# Altium schematic sheet Sheet1.SchDoc
size A4
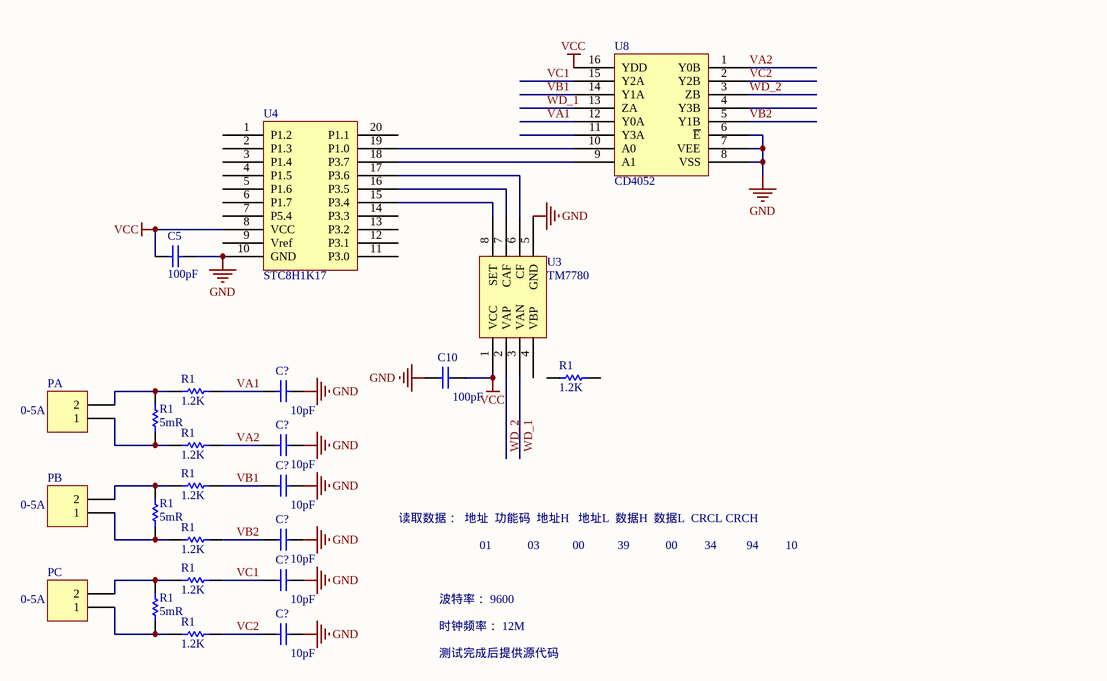
[diagram p0: Sheet1.SchDoc]

## Parts
(Parts that share a designator on the sheet are numbered #1, #2 ... from top to bottom, then left to right.)
C5  value 100pF  [RAD-0.3]  (hidden comment: Cap)
C10  value 100pF  [RAD-0.3]  (hidden comment: Cap)
C?#1  value 10pF  [RAD-0.3]  (hidden comment: Cap)
C?#2  value 10pF  [RAD-0.3]  (hidden comment: Cap)
C?#3  value 10pF  [RAD-0.3]  (hidden comment: Cap)
C?#4  value 10pF  [RAD-0.3]  (hidden comment: Cap)
C?#5  value 10pF  [RAD-0.3]  (hidden comment: Cap)
C?#6  value 10pF  [RAD-0.3]  (hidden comment: Cap)
PA  Header 2H  [HDR1X2H]  (value not drawn)
PB  Header 2H  [HDR1X2H]  (value not drawn)
PC  Header 2H  [HDR1X2H]  (value not drawn)
R1#1  value 1.2K  [AXIAL-0.3]  (hidden comment: Res1)
R1#2  value 1.2K  [AXIAL-0.3]  (hidden comment: Res1)
R1#3  value 5mR  [AXIAL-0.3]  (hidden comment: Res1)
R1#4  value 1.2K  [AXIAL-0.3]  (hidden comment: Res1)
R1#5  value 1.2K  [AXIAL-0.3]  (hidden comment: Res1)
R1#6  value 5mR  [AXIAL-0.3]  (hidden comment: Res1)
R1#7  value 1.2K  [AXIAL-0.3]  (hidden comment: Res1)
R1#8  value 1.2K  [AXIAL-0.3]  (hidden comment: Res1)
R1#9  value 5mR  [AXIAL-0.3]  (hidden comment: Res1)
R1#10  value 1.2K  [AXIAL-0.3]  (hidden comment: Res1)
U3  TM7780
U4  STC8H1K17
U8  CD4052

## Nets
GND: C5.2 C10.1 C?#1.2 C?#2.2 C?#3.2 C?#4.2 C?#5.2 C?#6.2 U3.5(GND) U4.10(GND) U8.6(~{E}) U8.7(VEE) U8.8(VSS)
VCC: C5.1 C10.2 U3.1(VCC) U4.8(VCC) U8.16(YDD)
VA1: C?#1.1 R1#2.2 U8.12(Y0A)
VA2: C?#2.1 R1#4.2 U8.1(Y0B)
VB1: C?#3.1 R1#5.2 U8.14(Y1A)
VB2: C?#4.1 R1#7.2 U8.5(Y1B)
VC1: C?#5.1 R1#8.2 U8.15(Y2A)
VC2: C?#6.1 R1#10.2 U8.2(Y2B)
WD_1: U3.3(VAN) U8.13(ZA)
WD_2: U3.2(VAP) U8.3(ZB)
NetPA_1: PA.1 R1#3.1 R1#4.1
NetPA_2: PA.2 R1#2.1 R1#3.2
NetPB_1: PB.1 R1#6.1 R1#7.1
NetPB_2: PB.2 R1#5.1 R1#6.2
NetPC_1: PC.1 R1#9.1 R1#10.1
NetPC_2: PC.2 R1#8.1 R1#9.2
NetU3_6: U3.6(CF) U4.17(P3.6)
NetU3_7: U3.7(CAF) U4.16(P3.5)
NetU3_8: U3.8(SET) U4.15(P3.4)
NetU4_18: U4.18(P3.7) U8.9(A1)
NetU4_19: U4.19(P1.0) U8.10(A0)

Not connected (* = marked no-connect by the designer): R1#1 1 2; U3 4(VBP); U4 1(P1.2) 2(P1.3) 3(P1.4) 4(P1.5) 5(P1.6) 6(P1.7) 7(P5.4) 9(Vref) 11(P3.0) 12(P3.1) 13(P3.2) 14(P3.3) 20(P1.1); U8 4(Y3B) 11(Y3A)

## Notes on the sheet
- (near PA) 0-5A
- (near PB) 0-5A
- 读取数据：  地址  功能码  地址H   地址L  数据H  数据L  CRCL CRCH
- 01            03           00           39            00         34          94         10
- (near PC) 0-5A
- 波特率： 9600
- 时钟频率： 12M
- 测试完成后提供源代码

## Library data of the parts
C5 C10 C?#1-C?#6 = Cap: Capacitor; Published: 8-Jun-2000; LatestRevisionDate: 17-Jul-2002; LatestRevisionNote: Re-released for DXP Platform.; PackageReference: RAD-0.3; Publisher: Altium Limited; PackageDescription: Radial Cap, Thru-Hole; 2 Leads; 0.3 in Pin Spacing
PA PB PC = Header 2H: Header, 2-Pin, Right Angle; LatestRevisionDate: 17-Jul-2002; LatestRevisionNote: Re-released for DXP Platform.; Publisher: Altium Limited
R1#1-R1#10 = Res1: Resistor; Published: 8-Jun-2000; LatestRevisionDate: 17-Jul-2002; LatestRevisionNote: Re-released for DXP Platform.; PackageReference: AXIAL-0.3; Publisher: Altium Limited; PackageDescription: Axial Device, Thru-Hole; 2 Leads; 0.3 in Pin Spacing
U3 = Component_1
U4 = Component_2
U8 = Component_3